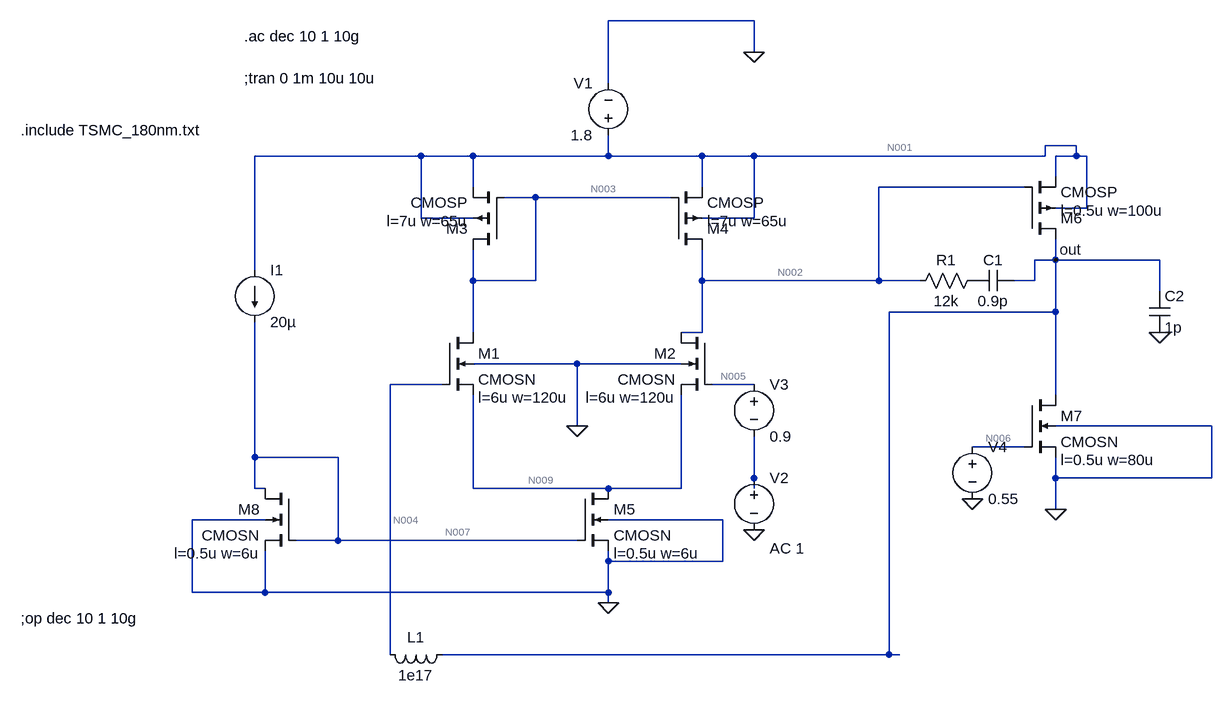
[diagram p0: schematic gain.asc]
gain.asc, the LTspice schematic file:
Version 4
SHEET 1 904 1024
WIRE 80 -128 -144 -128
WIRE 80 -80 80 -128
WIRE -144 -32 -144 -128
WIRE 576 64 528 64
WIRE -432 80 -688 80
WIRE -352 80 -432 80
WIRE -144 80 -144 48
WIRE -144 80 -352 80
WIRE 0 80 -144 80
WIRE 80 80 0 80
WIRE 528 80 528 64
WIRE 528 80 80 80
WIRE 576 80 576 64
WIRE 576 80 544 80
WIRE 592 80 576 80
WIRE 544 112 544 80
WIRE -352 128 -352 80
WIRE 0 128 0 80
WIRE 496 128 272 128
WIRE -256 144 -304 144
WIRE -48 144 -256 144
WIRE 592 160 592 80
WIRE 592 160 544 160
WIRE -432 176 -432 80
WIRE -352 176 -432 176
WIRE 80 176 80 80
WIRE 80 176 0 176
WIRE 544 240 544 208
WIRE 544 240 512 240
WIRE 704 240 544 240
WIRE -688 256 -688 80
WIRE -352 272 -352 224
WIRE -256 272 -256 144
WIRE -256 272 -352 272
WIRE 0 272 0 224
WIRE 272 272 272 128
WIRE 272 272 0 272
WIRE 336 272 272 272
WIRE 512 272 512 240
WIRE 512 272 480 272
WIRE 704 288 704 240
WIRE 544 320 544 240
WIRE 544 320 288 320
WIRE -352 352 -352 272
WIRE 0 352 0 272
WIRE 0 352 -32 352
WIRE -192 400 -352 400
WIRE -32 400 -192 400
WIRE -400 432 -480 432
WIRE 80 432 16 432
WIRE 544 448 544 320
WIRE -192 496 -192 400
WIRE 784 496 544 496
WIRE 496 528 416 528
WIRE -688 544 -688 336
WIRE -560 544 -688 544
WIRE 80 576 80 512
WIRE 544 576 544 544
WIRE 784 576 784 496
WIRE 784 576 544 576
WIRE -688 592 -688 544
WIRE -672 592 -688 592
WIRE -352 592 -352 448
WIRE -144 592 -352 592
WIRE -32 592 -32 448
WIRE -32 592 -144 592
WIRE 80 592 80 576
WIRE 544 624 544 576
WIRE -672 640 -784 640
WIRE 32 640 -144 640
WIRE -560 672 -560 544
WIRE -560 672 -624 672
WIRE -192 672 -560 672
WIRE -144 704 -144 688
WIRE 32 704 32 640
WIRE 32 704 -144 704
WIRE -784 752 -784 640
WIRE -672 752 -672 688
WIRE -672 752 -784 752
WIRE -144 752 -144 704
WIRE -144 752 -672 752
WIRE -144 768 -144 752
WIRE -480 848 -480 432
WIRE 288 848 288 320
WIRE 288 848 -400 848
WIRE 304 848 288 848
FLAG 80 -80 0
FLAG -144 768 0
FLAG 544 624 0
FLAG 416 608 0
FLAG 704 352 0
FLAG -192 496 0
FLAG 544 240 out
FLAG 80 656 0
DATAFLAG -32 576 ""
DATAFLAG 544 432 ""
DATAFLAG 448 336 ""
DATAFLAG -240 672 ""
DATAFLAG -256 400 ""
DATAFLAG -352 336 ""
DATAFLAG 0 272 ""
DATAFLAG 608 240 ""
SYMBOL nmos4 -400 352 R0
WINDOW 123 56 100 Left 2
SYMATTR Value2 l=6u w=120u
SYMATTR InstName M1
SYMATTR Value CMOSN
SYMBOL nmos4 16 352 M0
WINDOW 123 56 100 Left 2
SYMATTR Value2 l=6u w=120u
SYMATTR InstName M2
SYMATTR Value CMOSN
SYMBOL nmos4 -192 592 R0
WINDOW 123 56 100 Left 2
SYMATTR Value2 l=0.5u w=6u
SYMATTR InstName M5
SYMATTR Value CMOSN
SYMBOL pmos4 496 208 M180
WINDOW 123 56 44 Left 2
SYMATTR Value2 l=0.5u w=100u
SYMATTR InstName M6
SYMATTR Value CMOSP
SYMBOL nmos4 496 448 R0
WINDOW 123 56 100 Left 2
SYMATTR Value2 l=0.5u w=80u
SYMATTR InstName M7
SYMATTR Value CMOSN
SYMBOL voltage -144 64 R180
WINDOW 0 24 96 Left 2
WINDOW 3 24 16 Left 2
WINDOW 123 0 0 Left 0
WINDOW 39 0 0 Left 0
SYMATTR InstName V1
SYMATTR Value 1.8
SYMBOL current -688 256 R0
WINDOW 123 0 0 Left 0
WINDOW 39 0 0 Left 0
SYMATTR InstName I1
SYMATTR Value 20µ
SYMBOL nmos4 -624 592 M0
WINDOW 123 56 100 Left 2
SYMATTR Value2 l=0.5u w=6u
SYMATTR InstName M8
SYMATTR Value CMOSN
SYMBOL voltage 80 416 R0
WINDOW 123 0 0 Left 0
WINDOW 39 0 0 Left 0
SYMATTR InstName V3
SYMATTR Value 0.9
SYMBOL voltage 416 512 R0
WINDOW 123 0 0 Left 0
WINDOW 39 0 0 Left 0
SYMATTR InstName V4
SYMATTR Value 0.55
SYMBOL cap 688 288 R0
SYMATTR InstName C2
SYMATTR Value 1p
SYMBOL pmos4 -304 224 R180
WINDOW 123 56 44 Left 2
SYMATTR Value2 l=7u w=65u
SYMATTR InstName M3
SYMATTR Value CMOSP
SYMBOL pmos4 -48 224 M180
WINDOW 123 56 44 Left 2
SYMATTR Value2 l=7u w=65u
SYMATTR InstName M4
SYMATTR Value CMOSP
SYMBOL ind -384 832 R90
WINDOW 0 5 56 VBottom 2
WINDOW 3 32 56 VTop 2
SYMATTR InstName L1
SYMATTR Value 1e17
SYMBOL cap 480 256 R90
WINDOW 0 0 32 VBottom 2
WINDOW 3 32 32 VTop 2
SYMATTR InstName C1
SYMATTR Value 0.9p
SYMBOL res 432 256 R90
WINDOW 0 0 56 VBottom 2
WINDOW 3 32 56 VTop 2
SYMATTR InstName R1
SYMATTR Value 12k
SYMBOL voltage 80 560 R0
WINDOW 123 24 124 Left 2
WINDOW 39 0 0 Left 0
SYMATTR Value2 AC 1
SYMATTR InstName V2
SYMATTR Value ""
TEXT -1048 40 Left 2 !.include TSMC_180nm.txt
TEXT -1048 792 Left 2 !;op dec 10 1 10g
TEXT -704 -104 Left 2 !.ac dec 10 1 10g
TEXT -704 -40 Left 2 !;tran 0 1m 10u 10u

The netlist it stands for:
* gain.asc
M1 N003 N004 N009 0 CMOSN l=6u w=120u
M2 N002 N005 N009 0 CMOSN l=6u w=120u
M5 N009 N007 0 0 CMOSN l=0.5u w=6u
M6 out N002 N001 N001 CMOSP l=0.5u w=100u
M7 out N006 0 0 CMOSN l=0.5u w=80u
V1 N001 0 1.8
I1 N001 N007 20µ
M8 N007 N007 0 0 CMOSN l=0.5u w=6u
V3 N005 N008 0.9
V4 N006 0 0.55
C2 out 0 1p
M3 N003 N003 N001 N001 CMOSP l=7u w=65u
M4 N002 N003 N001 N001 CMOSP l=7u w=65u
L1 out N004 1e17
C1 out P001 0.9p
R1 P001 N002 12k
V2 N008 0 AC 1
.model NMOS NMOS
.model PMOS PMOS
.lib standard.mos
.include TSMC_180nm.txt
;op dec 10 1 10g
.ac dec 10 1 10g
;tran 0 1m 10u 10u
.backanno
.end

* Results of the author's LTspice run, read from the files saved beside the schematic
* Operating Point, zero values left out:
*   V(n003) = 1.181 V
*   V(n004) = 900 mV
*   V(n009) = 349.8 mV
*   V(n002) = 1.199 V
*   V(n005) = 900 mV
*   V(n007) = 578.2 mV
*   V(out) = 900 mV
*   V(n001) = 1.8 V
*   V(n006) = 550 mV
*   V(p001) = 1.199 V
*   Id(M4) = -9.585 µA
*   Is(M4) = 9.585 µA
*   Id(M3) = -9.587 µA
*   Is(M3) = 9.587 µA
*   Id(M6) = -176.8 µA
*   Is(M6) = 176.8 µA
*   Id(M8) = 20 µA
*   Is(M8) = -20 µA
*   Id(M7) = 176.8 µA
*   Is(M7) = -176.8 µA
*   Id(M5) = 19.17 µA
*   Is(M5) = -19.17 µA
*   Id(M2) = 9.585 µA
*   Ib(M2) = -1.568 pA
*   Is(M2) = -9.585 µA
*   Id(M1) = 9.587 µA
*   Ib(M1) = -1.551 pA
*   Is(M1) = -9.587 µA
*   I(I1) = 20 µA
*   I(V1) = -216 µA
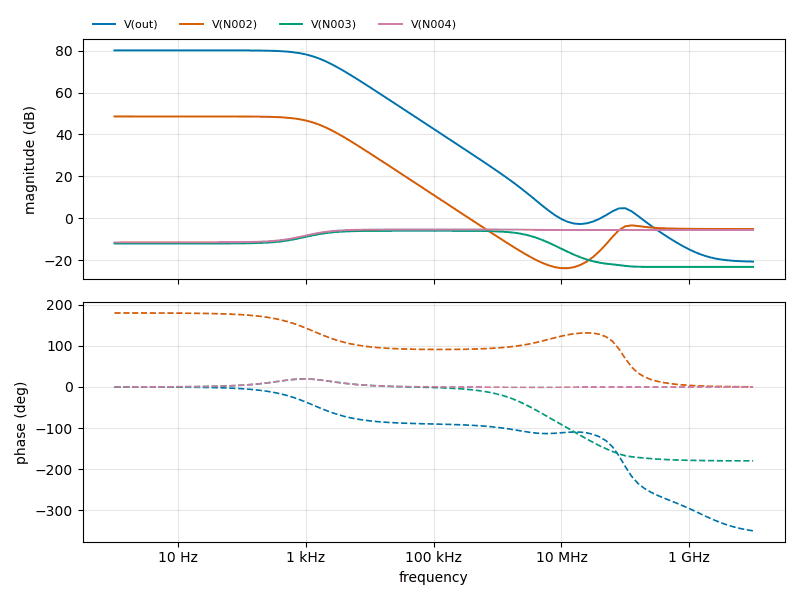
[diagram p1: AC Analysis of gain.asc, plotted from the saved traces]
* AC Analysis, 1 run:
*   V(out): 80.17 dB at 1 Hz, -20.65 dB at 10 GHz, peak 80.17 dB at 1 Hz, 3 dB below the peak at 1.319 kHz
*   V(N002): 48.62 dB at 1 Hz, -5.10 dB at 10 GHz, peak 48.62 dB at 1 Hz, 3 dB below the peak at 1.319 kHz
*   V(N003): -11.99 dB at 1 Hz, -23.18 dB at 10 GHz, peak -5.95 dB at 63.1 kHz, 3 dB below the peak at 944.7 Hz and 3.74 MHz
*   V(N004): -11.48 dB at 1 Hz, -5.56 dB at 10 GHz, peak -5.34 dB at 125.9 kHz, 3 dB below the peak at 946.9 Hz